# Altium schematic sheet PWR.SchDoc
size A4; Organization: Altium Limited; Address1: L3, 12a Rodborough Rd; Address2: Frenchs Forest; Address3: NSW; Address4: Australia 2086
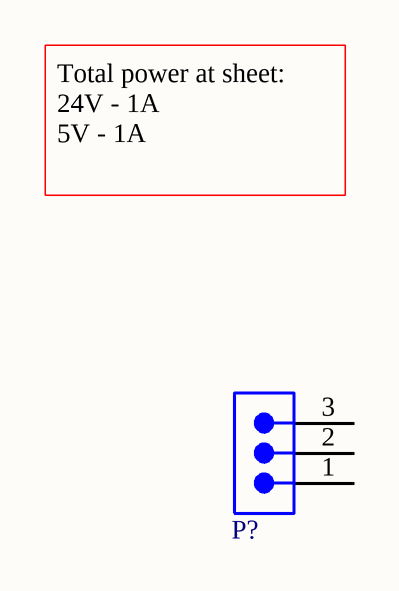
[diagram p0: PWR.SchDoc]

## Parts
P?  691313410003  [691313410003]  (value not drawn)

## Nets

Not connected (* = marked no-connect by the designer): P? 1 2 3

## Notes on the sheet
- Total power at sheet:
  24V - 1A
  5V - 1A
- Title
- Size:
- Date:
- A4
- Number:
- Time:
- Revision:
- Sheet
- of
- File:

## Library data of the parts
P? = 691313410003: WR-TBL Series 3134 Close Horizontal PCB Header, THT, pitch 7.62mm, 3p; Manufacturer: Wurth Elektronik; Modularity: No; Rated Current: 20A; Working Voltage: 300V; ComponentLink1Description: Website Link; ComponentLink1URL: https://www.we-online.com/redexpert/article/691313410003?ad; ComponentLink2Description: Datasheet Link; ComponentLink2URL: https://www.we-online.com/redexpert/spec/691313410003?ad; Manufacturer Part Number: 691313410003; Category: Terminal Blocks; Match Code: WR-TBL; Mount: Through Hole; Operating Temperature Max: 105°C; Operating Temperature Min: -40°C; Packaging: Box; Application: Pluggable; Number of Pins: 3; Number of Rows: 1; Orientation: Horizontal; Pitch: 7.62mm